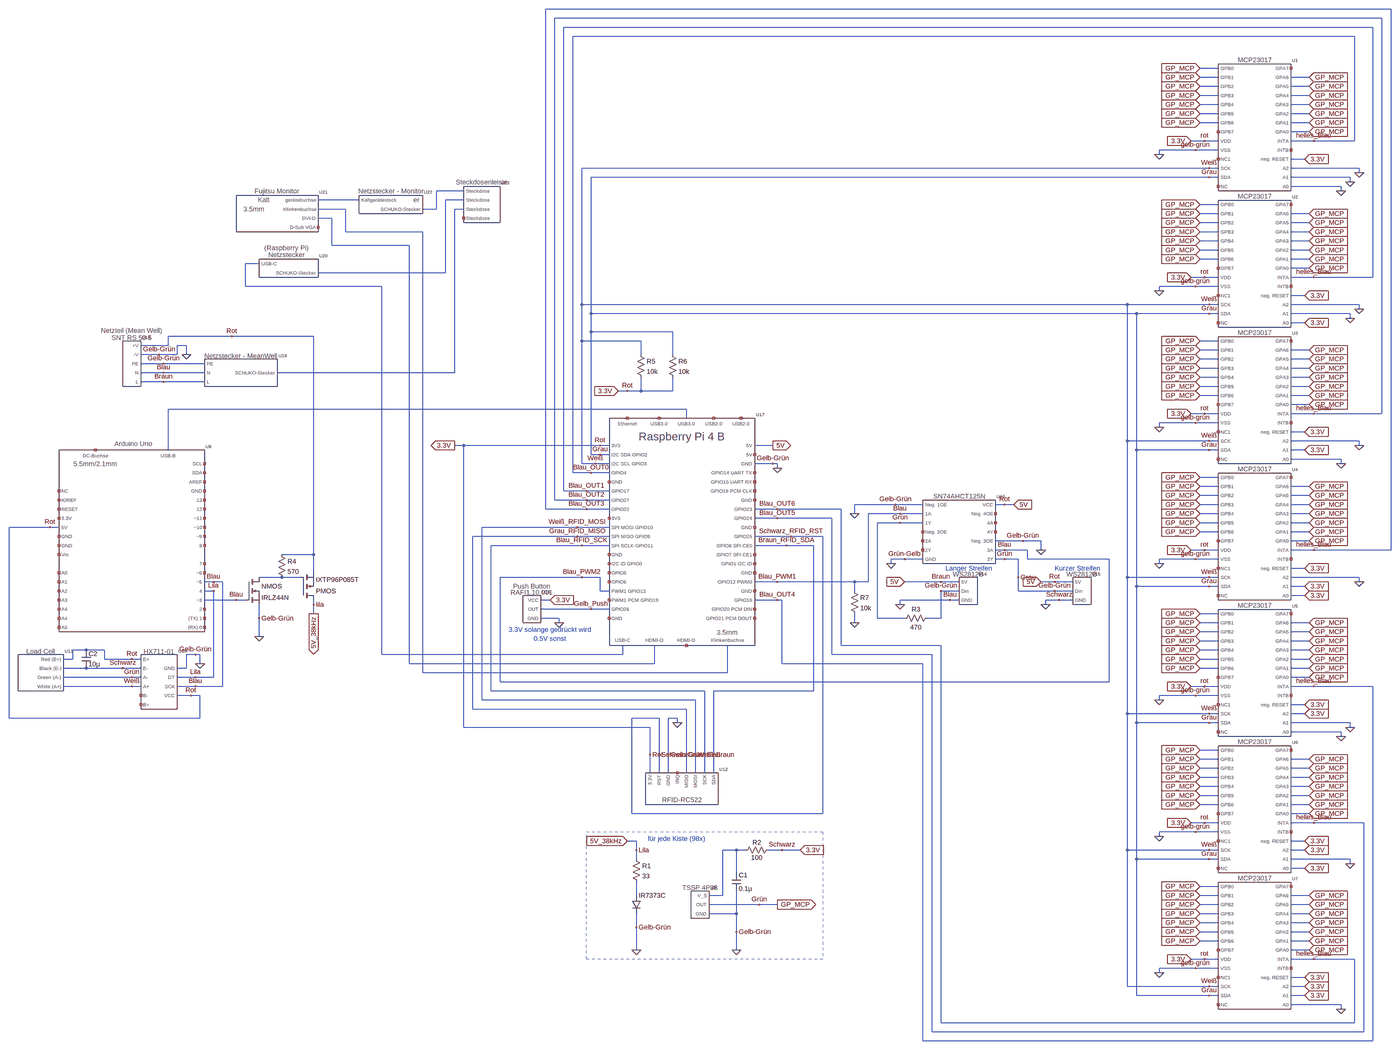
[diagram p0: schematic 260305_Schaltung_Pick-by-Light.asc, whole sheet]
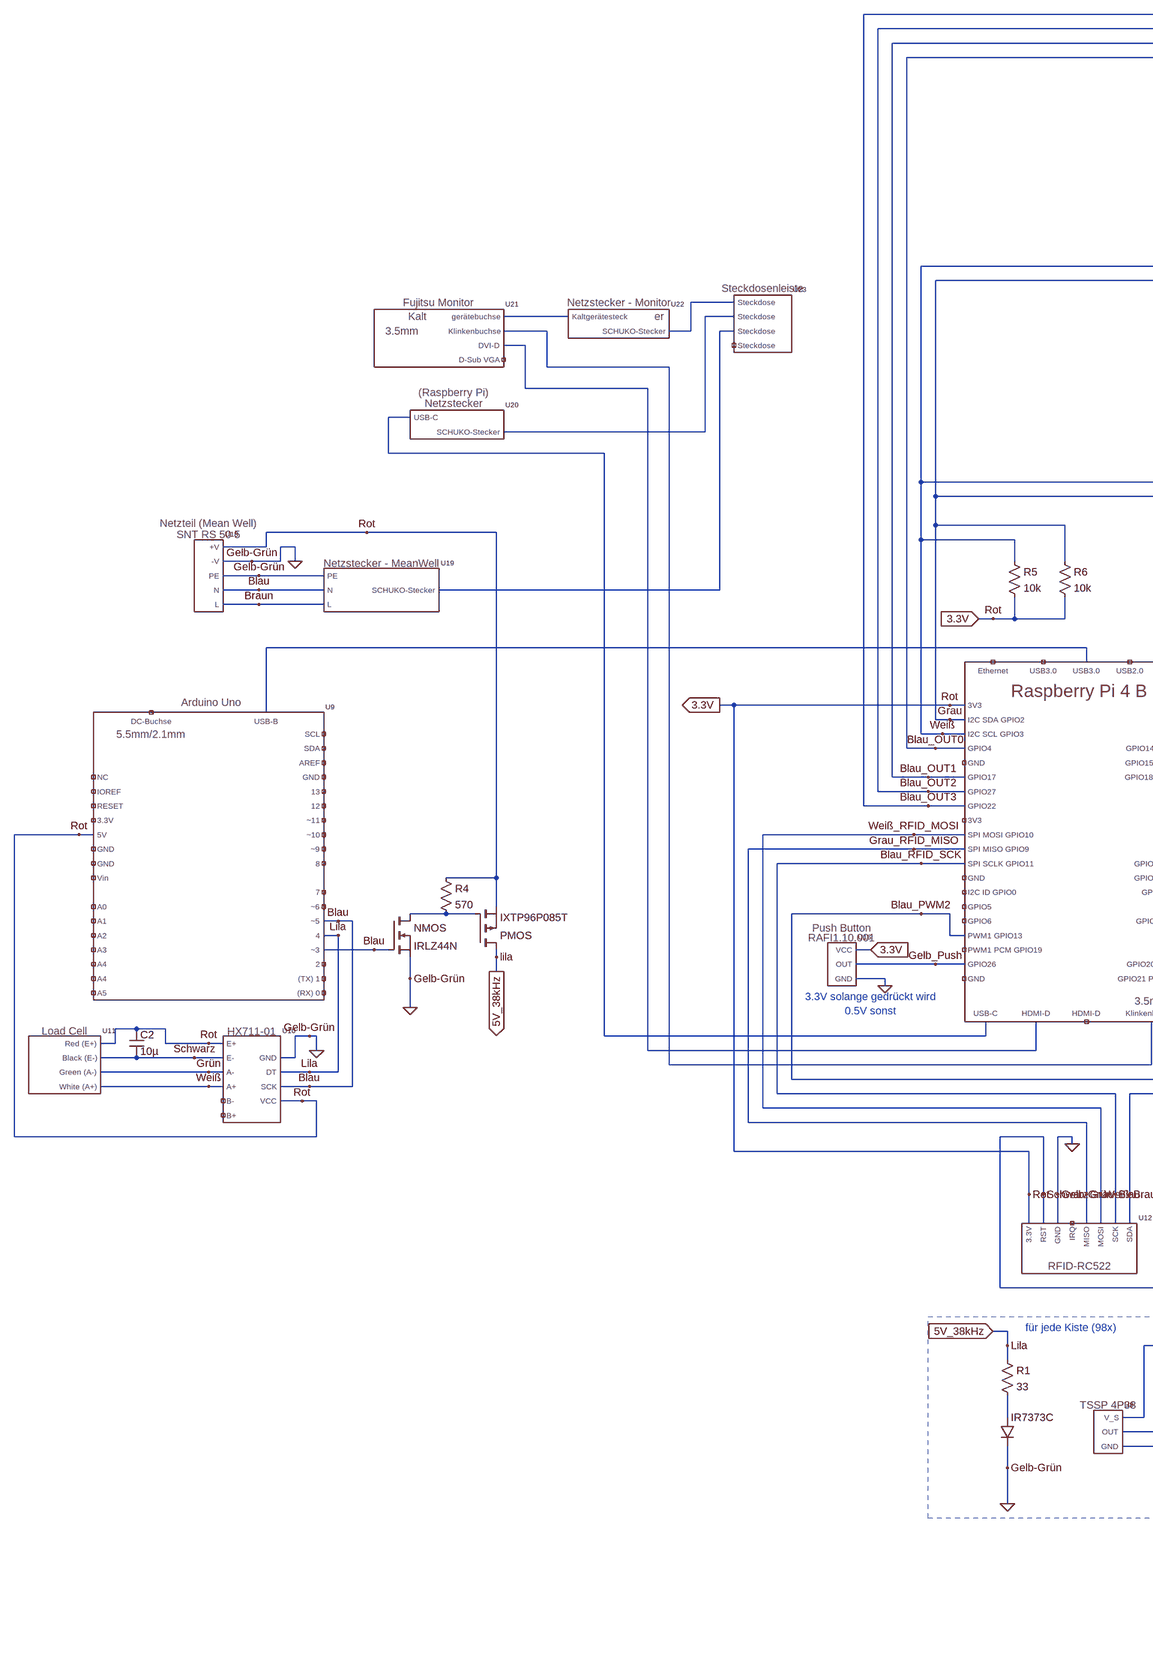
[diagram p1: schematic 260305_Schaltung_Pick-by-Light.asc, part, row 1 of 1, column 1 of 2]
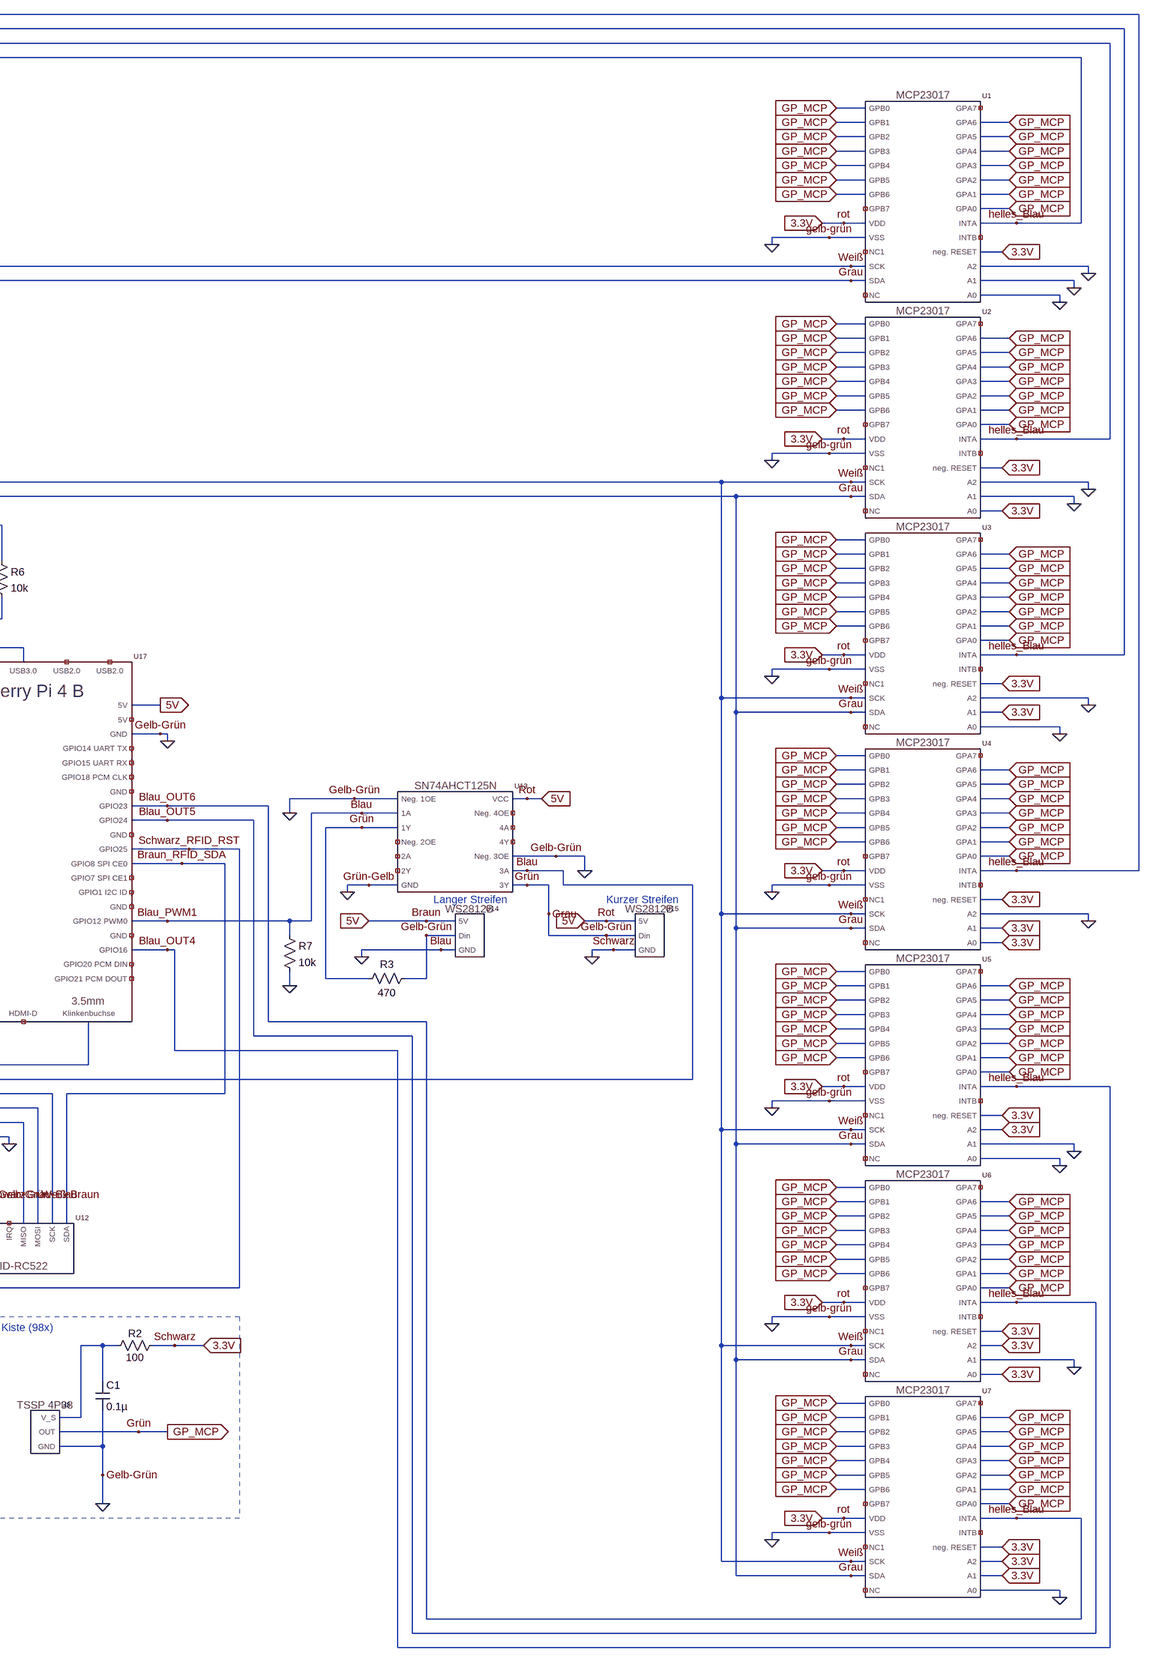
[diagram p2: schematic 260305_Schaltung_Pick-by-Light.asc, part, row 1 of 1, column 2 of 2]
260305_Schaltung_Pick-by-Light.asc, the LTspice schematic file:
Version 4
SHEET 1 2196 3236
WIRE 2048 -416 -928 -416
WIRE 2016 -384 -896 -384
WIRE 1984 -352 -864 -352
WIRE 1920 -320 -832 -320
WIRE 1440 -208 1376 -208
WIRE 1440 -176 1376 -176
WIRE 1760 -176 1696 -176
WIRE 1440 -144 1376 -144
WIRE 1760 -144 1696 -144
WIRE 1440 -112 1376 -112
WIRE 1760 -112 1696 -112
WIRE 1440 -80 1376 -80
WIRE 1760 -80 1696 -80
WIRE 1440 -48 1376 -48
WIRE 1760 -48 1696 -48
WIRE 1440 -16 1376 -16
WIRE 1760 -16 1696 -16
WIRE 1760 16 1696 16
WIRE 1392 48 1344 48
WIRE 1440 48 1392 48
WIRE 1776 48 1696 48
WIRE 1920 48 1920 -320
WIRE 1920 48 1776 48
WIRE 1360 80 1232 80
WIRE 1440 80 1360 80
WIRE 1232 96 1232 80
WIRE 1744 112 1696 112
WIRE 1408 144 -800 144
WIRE 1440 144 1408 144
WIRE 1936 144 1696 144
WIRE 1936 160 1936 144
WIRE 1408 176 -768 176
WIRE 1440 176 1408 176
WIRE 1904 176 1696 176
WIRE 1904 192 1904 176
WIRE 1872 208 1696 208
WIRE -1216 224 -1312 224
WIRE 1872 224 1872 208
WIRE -1584 256 -1728 256
WIRE -1216 256 -1280 256
WIRE 1440 272 1376 272
WIRE -1632 288 -1728 288
WIRE -1312 288 -1312 224
WIRE -1312 288 -1360 288
WIRE -1216 288 -1248 288
WIRE 1440 304 1376 304
WIRE 1760 304 1696 304
WIRE -1680 320 -1728 320
WIRE 1440 336 1376 336
WIRE 1760 336 1696 336
WIRE -1632 368 -1632 288
WIRE -1360 368 -1632 368
WIRE 1440 368 1376 368
WIRE 1760 368 1696 368
WIRE 1440 400 1376 400
WIRE 1760 400 1696 400
WIRE -1680 416 -1680 320
WIRE -1408 416 -1680 416
WIRE 1440 432 1376 432
WIRE 1760 432 1696 432
WIRE 1440 464 1376 464
WIRE 1760 464 1696 464
WIRE -1936 480 -1984 480
WIRE 1760 496 1696 496
WIRE -1280 512 -1280 256
WIRE -1280 512 -1728 512
WIRE 1392 528 1344 528
WIRE 1440 528 1392 528
WIRE 1776 528 1696 528
WIRE 1984 528 1984 -352
WIRE 1984 528 1776 528
WIRE -1984 560 -1984 480
WIRE -1504 560 -1984 560
WIRE 1360 560 1232 560
WIRE 1440 560 1360 560
WIRE 1232 576 1232 560
WIRE 1744 592 1696 592
WIRE -800 624 -800 144
WIRE 1120 624 -800 624
WIRE 1408 624 1120 624
WIRE 1440 624 1408 624
WIRE 1936 624 1696 624
WIRE 1936 640 1936 624
WIRE -768 656 -768 176
WIRE 1152 656 -768 656
WIRE 1408 656 1152 656
WIRE 1440 656 1408 656
WIRE 1904 656 1696 656
WIRE 1904 672 1904 656
WIRE 1744 688 1696 688
WIRE -768 720 -768 656
WIRE -480 720 -768 720
WIRE -2032 736 -2256 736
WIRE -1744 736 -2032 736
WIRE -800 752 -800 624
WIRE -592 752 -800 752
WIRE 1440 752 1376 752
WIRE -2256 768 -2256 736
WIRE -2256 768 -2352 768
WIRE -2192 768 -2224 768
WIRE 1440 784 1376 784
WIRE 1760 784 1696 784
WIRE -2288 800 -2352 800
WIRE -2224 800 -2224 768
WIRE -2224 800 -2288 800
WIRE -2192 800 -2192 768
WIRE -592 800 -592 752
WIRE -480 800 -480 720
WIRE 1440 816 1376 816
WIRE 1760 816 1696 816
WIRE -2272 832 -2352 832
WIRE -2128 832 -2272 832
WIRE 1440 848 1376 848
WIRE 1760 848 1696 848
WIRE -2272 864 -2352 864
WIRE -2128 864 -2272 864
WIRE -1248 864 -1248 288
WIRE -1248 864 -1872 864
WIRE 1440 880 1376 880
WIRE 1760 880 1696 880
WIRE -2272 896 -2352 896
WIRE -2128 896 -2272 896
WIRE 1440 912 1376 912
WIRE 1760 912 1696 912
WIRE -640 928 -672 928
WIRE -592 928 -592 880
WIRE -592 928 -640 928
WIRE -480 928 -480 880
WIRE -480 928 -592 928
WIRE 1440 944 1376 944
WIRE 1760 944 1696 944
WIRE 1760 976 1696 976
WIRE -432 992 -2256 992
WIRE 1392 1008 1344 1008
WIRE 1440 1008 1392 1008
WIRE 1776 1008 1696 1008
WIRE 2016 1008 2016 -384
WIRE 2016 1008 1776 1008
WIRE -432 1024 -432 992
WIRE 1360 1040 1232 1040
WIRE 1440 1040 1360 1040
WIRE 1232 1056 1232 1040
WIRE 1744 1072 1696 1072
WIRE 1120 1104 1120 624
WIRE 1408 1104 1120 1104
WIRE 1440 1104 1408 1104
WIRE 1936 1104 1696 1104
WIRE -1216 1120 -1248 1120
WIRE -736 1120 -1216 1120
WIRE -704 1120 -736 1120
WIRE -128 1120 -192 1120
WIRE 1936 1120 1936 1104
WIRE -2256 1136 -2256 992
WIRE 1152 1136 1152 656
WIRE 1408 1136 1152 1136
WIRE 1440 1136 1408 1136
WIRE 1744 1136 1696 1136
WIRE -768 1152 -768 720
WIRE -736 1152 -768 1152
WIRE -704 1152 -736 1152
WIRE 1872 1168 1696 1168
WIRE -800 1184 -800 752
WIRE -752 1184 -800 1184
WIRE -704 1184 -752 1184
WIRE -128 1184 -192 1184
WIRE -112 1184 -128 1184
WIRE 1872 1184 1872 1168
WIRE -112 1200 -112 1184
WIRE -832 1216 -832 -320
WIRE -768 1216 -832 1216
WIRE -704 1216 -768 1216
WIRE 1440 1232 1376 1232
WIRE 1440 1264 1376 1264
WIRE 1760 1264 1696 1264
WIRE -864 1280 -864 -352
WIRE -784 1280 -864 1280
WIRE -704 1280 -784 1280
WIRE 1440 1296 1376 1296
WIRE 1760 1296 1696 1296
WIRE -896 1312 -896 -384
WIRE -784 1312 -896 1312
WIRE -704 1312 -784 1312
WIRE 304 1328 160 1328
WIRE 400 1328 304 1328
WIRE 688 1328 656 1328
WIRE 720 1328 688 1328
WIRE 1440 1328 1376 1328
WIRE 1760 1328 1696 1328
WIRE -928 1344 -928 -416
WIRE -784 1344 -928 1344
WIRE -704 1344 -784 1344
WIRE -112 1344 -192 1344
WIRE 112 1344 -112 1344
WIRE 160 1360 160 1328
WIRE 320 1360 208 1360
WIRE 400 1360 320 1360
WIRE 1440 1360 1376 1360
WIRE 1760 1360 1696 1360
WIRE -112 1376 -192 1376
WIRE 80 1376 -112 1376
WIRE 320 1392 240 1392
WIRE 400 1392 320 1392
WIRE 1440 1392 1376 1392
WIRE 1760 1392 1696 1392
WIRE -2672 1408 -2816 1408
WIRE -2640 1408 -2672 1408
WIRE -816 1408 -1152 1408
WIRE -704 1408 -816 1408
WIRE 1440 1424 1376 1424
WIRE 1760 1424 1696 1424
WIRE -816 1440 -1184 1440
WIRE -704 1440 -816 1440
WIRE -64 1440 -192 1440
WIRE 48 1440 -64 1440
WIRE 752 1456 656 1456
WIRE 816 1456 752 1456
WIRE 1760 1456 1696 1456
WIRE -800 1472 -1120 1472
WIRE -704 1472 -800 1472
WIRE -80 1472 -192 1472
WIRE 16 1472 -80 1472
WIRE 688 1488 656 1488
WIRE 768 1488 688 1488
WIRE 816 1488 816 1456
WIRE 1392 1488 1344 1488
WIRE 1440 1488 1392 1488
WIRE 1776 1488 1696 1488
WIRE 2048 1488 2048 -416
WIRE 2048 1488 1776 1488
WIRE -1744 1504 -1744 736
WIRE -1744 1504 -1856 1504
WIRE 336 1520 288 1520
WIRE 400 1520 336 1520
WIRE 688 1520 656 1520
WIRE 736 1520 688 1520
WIRE 768 1520 768 1488
WIRE 1056 1520 768 1520
WIRE 1360 1520 1232 1520
WIRE 1440 1520 1360 1520
WIRE 288 1536 288 1520
WIRE 1232 1536 1232 1520
WIRE 1744 1552 1696 1552
WIRE -1744 1568 -1744 1504
WIRE -1856 1584 -1936 1584
WIRE -1792 1584 -1856 1584
WIRE -800 1584 -1088 1584
WIRE -736 1584 -800 1584
WIRE 736 1584 736 1520
WIRE 1120 1584 1120 1104
WIRE 1408 1584 1120 1584
WIRE 1440 1584 1408 1584
WIRE 1936 1584 1696 1584
WIRE -2096 1600 -2128 1600
WIRE -2064 1600 -2096 1600
WIRE -112 1600 -192 1600
WIRE 160 1600 -112 1600
WIRE 208 1600 208 1360
WIRE 208 1600 160 1600
WIRE 464 1600 336 1600
WIRE 528 1600 464 1600
WIRE 864 1600 816 1600
WIRE 928 1600 864 1600
WIRE 1936 1600 1936 1584
WIRE 1152 1616 1152 1136
WIRE 1408 1616 1152 1616
WIRE 1440 1616 1408 1616
WIRE 1744 1616 1696 1616
WIRE -2096 1632 -2128 1632
WIRE -736 1632 -736 1584
WIRE -704 1632 -736 1632
WIRE 160 1632 160 1600
WIRE 528 1632 464 1632
WIRE 736 1632 736 1584
WIRE 864 1632 736 1632
WIRE 928 1632 864 1632
WIRE 1744 1648 1696 1648
WIRE -2016 1664 -2128 1664
WIRE -1984 1664 -2016 1664
WIRE -912 1664 -944 1664
WIRE -112 1664 -192 1664
WIRE -96 1664 -112 1664
WIRE 496 1664 320 1664
WIRE 528 1664 496 1664
WIRE 880 1664 832 1664
WIRE 928 1664 880 1664
WIRE -1744 1680 -1744 1664
WIRE 320 1680 320 1664
WIRE 832 1680 832 1664
WIRE -768 1696 -944 1696
WIRE -704 1696 -768 1696
WIRE -1744 1712 -1744 1680
WIRE 1440 1712 1376 1712
WIRE -1936 1728 -1936 1680
WIRE -880 1728 -944 1728
WIRE 240 1728 240 1392
WIRE 336 1728 240 1728
WIRE 464 1728 464 1632
WIRE 464 1728 416 1728
WIRE -880 1744 -880 1728
WIRE 160 1744 160 1712
WIRE 1440 1744 1376 1744
WIRE 1760 1744 1696 1744
WIRE 1440 1776 1376 1776
WIRE 1760 1776 1696 1776
WIRE -1936 1792 -1936 1728
WIRE 1440 1808 1376 1808
WIRE 1760 1808 1696 1808
WIRE 112 1824 112 1344
WIRE 464 1824 112 1824
WIRE -2544 1840 -2592 1840
WIRE -2480 1840 -2544 1840
WIRE 1440 1840 1376 1840
WIRE 1760 1840 1696 1840
WIRE -2160 1856 -2192 1856
WIRE -2144 1856 -2160 1856
WIRE -1504 1856 -1504 560
WIRE -656 1856 -656 1824
WIRE -656 1856 -1504 1856
WIRE 80 1856 80 1376
WIRE 432 1856 80 1856
WIRE -2592 1872 -2592 1840
WIRE -2592 1872 -2624 1872
WIRE -2480 1872 -2480 1840
WIRE -2384 1872 -2480 1872
WIRE -2352 1872 -2384 1872
WIRE 1440 1872 1376 1872
WIRE 1760 1872 1696 1872
WIRE -2144 1888 -2144 1856
WIRE -1408 1888 -1408 416
WIRE -544 1888 -544 1824
WIRE -544 1888 -1408 1888
WIRE -96 1888 -96 1664
WIRE 400 1888 -96 1888
WIRE -2544 1904 -2624 1904
WIRE -2416 1904 -2544 1904
WIRE -2352 1904 -2416 1904
WIRE -2192 1904 -2192 1856
WIRE -2192 1904 -2224 1904
WIRE 1440 1904 1376 1904
WIRE 1760 1904 1696 1904
WIRE -1360 1920 -1360 368
WIRE -288 1920 -288 1824
WIRE -288 1920 -1360 1920
WIRE -2384 1936 -2624 1936
WIRE -2352 1936 -2384 1936
WIRE -2160 1936 -2224 1936
WIRE -2096 1936 -2096 1632
WIRE -2096 1936 -2160 1936
WIRE 1760 1936 1696 1936
WIRE -1088 1952 -1088 1584
WIRE 1056 1952 1056 1520
WIRE 1056 1952 -1088 1952
WIRE -2384 1968 -2624 1968
WIRE -2352 1968 -2384 1968
WIRE -2160 1968 -2224 1968
WIRE -2064 1968 -2064 1600
WIRE -2064 1968 -2160 1968
WIRE 1392 1968 1344 1968
WIRE 1440 1968 1392 1968
WIRE 1776 1968 1696 1968
WIRE 1984 1968 1776 1968
WIRE -1120 1984 -1120 1472
WIRE -368 1984 -1120 1984
WIRE 16 1984 16 1472
WIRE 16 1984 -336 1984
WIRE -2176 2000 -2224 2000
WIRE -2144 2000 -2176 2000
WIRE 1360 2000 1232 2000
WIRE 1440 2000 1360 2000
WIRE -1152 2016 -1152 1408
WIRE -400 2016 -1152 2016
WIRE 1232 2016 1232 2000
WIRE 1744 2032 1696 2032
WIRE -1184 2048 -1184 1440
WIRE -432 2048 -1184 2048
WIRE 1120 2064 1120 1584
WIRE 1408 2064 1120 2064
WIRE 1440 2064 1408 2064
WIRE 1744 2064 1696 2064
WIRE -2816 2080 -2816 1408
WIRE -2144 2080 -2144 2000
WIRE -2144 2080 -2816 2080
WIRE -528 2080 -624 2080
WIRE -464 2080 -496 2080
WIRE -464 2096 -464 2080
WIRE 1152 2096 1152 1616
WIRE 1408 2096 1152 2096
WIRE 1440 2096 1408 2096
WIRE 1904 2096 1696 2096
WIRE -1216 2112 -1216 1120
WIRE -560 2112 -1216 2112
WIRE 1904 2112 1904 2096
WIRE 1872 2128 1696 2128
WIRE 1872 2144 1872 2128
WIRE 1440 2192 1376 2192
WIRE -560 2208 -560 2112
WIRE -528 2208 -528 2080
WIRE -496 2208 -496 2080
WIRE -432 2208 -432 2048
WIRE -400 2208 -400 2016
WIRE -368 2208 -368 1984
WIRE -336 2208 -336 1984
WIRE 1440 2224 1376 2224
WIRE 1760 2224 1696 2224
WIRE 1440 2256 1376 2256
WIRE 1760 2256 1696 2256
WIRE -560 2272 -560 2208
WIRE -528 2272 -528 2208
WIRE -496 2272 -496 2208
WIRE -432 2272 -432 2208
WIRE -400 2272 -400 2208
WIRE -368 2272 -368 2208
WIRE -336 2272 -336 2208
WIRE 1440 2288 1376 2288
WIRE 1760 2288 1696 2288
WIRE 1440 2320 1376 2320
WIRE 1760 2320 1696 2320
WIRE 1440 2352 1376 2352
WIRE 1760 2352 1696 2352
WIRE 1440 2384 1376 2384
WIRE 1760 2384 1696 2384
WIRE -624 2416 -624 2080
WIRE 48 2416 48 1440
WIRE 48 2416 -624 2416
WIRE 1760 2416 1696 2416
WIRE 1392 2448 1344 2448
WIRE 1440 2448 1392 2448
WIRE 1776 2448 1696 2448
WIRE 1952 2448 1776 2448
WIRE 1360 2480 1232 2480
WIRE 1440 2480 1360 2480
WIRE 1232 2496 1232 2480
WIRE -608 2512 -640 2512
WIRE 1744 2512 1696 2512
WIRE -608 2544 -608 2512
WIRE -256 2544 -304 2544
WIRE -224 2544 -256 2544
WIRE -96 2544 -144 2544
WIRE -32 2544 -96 2544
WIRE 1120 2544 1120 2064
WIRE 1408 2544 1120 2544
WIRE 1440 2544 1408 2544
WIRE 1744 2544 1696 2544
WIRE -608 2576 -608 2544
WIRE 1152 2576 1152 2096
WIRE 1408 2576 1152 2576
WIRE 1440 2576 1408 2576
WIRE 1904 2576 1696 2576
WIRE 1904 2592 1904 2576
WIRE 1744 2608 1696 2608
WIRE -256 2624 -256 2544
WIRE 1440 2672 1376 2672
WIRE -608 2704 -608 2656
WIRE -304 2704 -304 2544
WIRE -304 2704 -352 2704
WIRE 1440 2704 1376 2704
WIRE 1760 2704 1696 2704
WIRE -176 2736 -352 2736
WIRE -112 2736 -176 2736
WIRE 1440 2736 1376 2736
WIRE 1760 2736 1696 2736
WIRE -256 2768 -256 2688
WIRE -256 2768 -352 2768
WIRE 1440 2768 1376 2768
WIRE 1760 2768 1696 2768
WIRE 1440 2800 1376 2800
WIRE 1760 2800 1696 2800
WIRE -608 2816 -608 2768
WIRE -256 2832 -256 2768
WIRE 1440 2832 1376 2832
WIRE 1760 2832 1696 2832
WIRE 1440 2864 1376 2864
WIRE 1760 2864 1696 2864
WIRE -608 2896 -608 2816
WIRE -256 2896 -256 2832
WIRE 1760 2896 1696 2896
WIRE 1392 2928 1344 2928
WIRE 1440 2928 1392 2928
WIRE 1776 2928 1696 2928
WIRE 1920 2928 1776 2928
WIRE 1360 2960 1232 2960
WIRE 1440 2960 1360 2960
WIRE 1232 2976 1232 2960
WIRE 1744 2992 1696 2992
WIRE 1120 3024 1120 2544
WIRE 1408 3024 1120 3024
WIRE 1440 3024 1408 3024
WIRE 1744 3024 1696 3024
WIRE 1152 3056 1152 2576
WIRE 1408 3056 1152 3056
WIRE 1440 3056 1408 3056
WIRE 1744 3056 1696 3056
WIRE 1872 3088 1696 3088
WIRE 1872 3104 1872 3088
WIRE 464 3152 464 1824
WIRE 1920 3152 1920 2928
WIRE 1920 3152 464 3152
WIRE 432 3184 432 1856
WIRE 1952 3184 1952 2448
WIRE 1952 3184 432 3184
WIRE 400 3216 400 1888
WIRE 1984 3216 1984 1968
WIRE 1984 3216 400 3216
FLAG -128 1120 5V
IOPIN -128 1120 Out
FLAG 1344 528 3.3V
IOPIN 1344 528 In
FLAG 1344 48 3.3V
IOPIN 1344 48 In
FLAG 1344 1008 3.3V
IOPIN 1344 1008 In
FLAG 1344 1488 3.3V
IOPIN 1344 1488 In
FLAG 1344 1968 3.3V
IOPIN 1344 1968 In
FLAG 1344 2448 3.3V
IOPIN 1344 2448 In
FLAG 1344 2928 3.3V
IOPIN 1344 2928 In
FLAG 1744 688 3.3V
IOPIN 1744 688 In
FLAG 1744 1136 3.3V
IOPIN 1744 1136 In
FLAG 1744 1616 3.3V
IOPIN 1744 1616 In
FLAG 1744 1648 3.3V
IOPIN 1744 1648 In
FLAG 1744 2064 3.3V
IOPIN 1744 2064 In
FLAG 1744 2544 3.3V
IOPIN 1744 2544 In
FLAG 1744 2608 3.3V
IOPIN 1744 2608 In
FLAG 1744 3024 3.3V
IOPIN 1744 3024 In
FLAG 1744 3056 3.3V
IOPIN 1744 3056 In
FLAG -112 1200 0
FLAG 1936 1120 0
FLAG 1872 1184 0
FLAG 1936 1600 0
FLAG 1904 2112 0
FLAG 1872 2144 0
FLAG 1904 2592 0
FLAG 1872 3104 0
FLAG 1936 160 0
FLAG 1904 192 0
FLAG 1872 224 0
FLAG 1904 672 0
FLAG 1936 640 0
FLAG 1232 96 0
FLAG 1232 576 0
FLAG 1232 2976 0
FLAG 1232 2496 0
FLAG 1232 2016 0
FLAG 1232 1536 0
FLAG 1232 1056 0
FLAG 1744 1552 3.3V
IOPIN 1744 1552 In
FLAG 1744 1072 3.3V
IOPIN 1744 1072 In
FLAG 1744 592 3.3V
IOPIN 1744 592 In
FLAG 1744 112 3.3V
IOPIN 1744 112 In
FLAG 1744 2032 3.3V
IOPIN 1744 2032 In
FLAG 1744 2512 3.3V
IOPIN 1744 2512 In
FLAG 1744 2992 3.3V
IOPIN 1744 2992 In
FLAG -640 2512 5V_38kHz
IOPIN -640 2512 In
FLAG -608 2896 0
FLAG -32 2544 3.3V
IOPIN -32 2544 In
FLAG -256 2896 0
FLAG -112 2736 GP_MCP
IOPIN -112 2736 Out
FLAG 1376 -208 GP_MCP
IOPIN 1376 -208 In
FLAG 1376 -176 GP_MCP
IOPIN 1376 -176 In
FLAG 1376 -144 GP_MCP
IOPIN 1376 -144 In
FLAG 1376 -112 GP_MCP
IOPIN 1376 -112 In
FLAG 1376 -80 GP_MCP
IOPIN 1376 -80 In
FLAG 1376 -48 GP_MCP
IOPIN 1376 -48 In
FLAG 1376 -16 GP_MCP
IOPIN 1376 -16 In
FLAG 1760 -176 GP_MCP
IOPIN 1760 -176 In
FLAG 1760 -144 GP_MCP
IOPIN 1760 -144 In
FLAG 1760 -112 GP_MCP
IOPIN 1760 -112 In
FLAG 1760 -80 GP_MCP
IOPIN 1760 -80 In
FLAG 1760 -48 GP_MCP
IOPIN 1760 -48 In
FLAG 1760 -16 GP_MCP
IOPIN 1760 -16 In
FLAG 1760 16 GP_MCP
IOPIN 1760 16 In
FLAG 1760 304 GP_MCP
IOPIN 1760 304 In
FLAG 1760 336 GP_MCP
IOPIN 1760 336 In
FLAG 1760 368 GP_MCP
IOPIN 1760 368 In
FLAG 1760 400 GP_MCP
IOPIN 1760 400 In
FLAG 1760 432 GP_MCP
IOPIN 1760 432 In
FLAG 1760 464 GP_MCP
IOPIN 1760 464 In
FLAG 1760 496 GP_MCP
IOPIN 1760 496 In
FLAG 1760 784 GP_MCP
IOPIN 1760 784 In
FLAG 1760 816 GP_MCP
IOPIN 1760 816 In
FLAG 1760 848 GP_MCP
IOPIN 1760 848 In
FLAG 1760 880 GP_MCP
IOPIN 1760 880 In
FLAG 1760 912 GP_MCP
IOPIN 1760 912 In
FLAG 1760 944 GP_MCP
IOPIN 1760 944 In
FLAG 1760 976 GP_MCP
IOPIN 1760 976 In
FLAG 1760 1264 GP_MCP
IOPIN 1760 1264 In
FLAG 1760 1296 GP_MCP
IOPIN 1760 1296 In
FLAG 1760 1328 GP_MCP
IOPIN 1760 1328 In
FLAG 1760 1360 GP_MCP
IOPIN 1760 1360 In
FLAG 1760 1392 GP_MCP
IOPIN 1760 1392 In
FLAG 1760 1424 GP_MCP
IOPIN 1760 1424 In
FLAG 1760 1456 GP_MCP
IOPIN 1760 1456 In
FLAG 1760 1744 GP_MCP
IOPIN 1760 1744 In
FLAG 1760 1776 GP_MCP
IOPIN 1760 1776 In
FLAG 1760 1808 GP_MCP
IOPIN 1760 1808 In
FLAG 1760 1840 GP_MCP
IOPIN 1760 1840 In
FLAG 1760 1872 GP_MCP
IOPIN 1760 1872 In
FLAG 1760 1904 GP_MCP
IOPIN 1760 1904 In
FLAG 1760 1936 GP_MCP
IOPIN 1760 1936 In
FLAG 1760 2224 GP_MCP
IOPIN 1760 2224 In
FLAG 1760 2256 GP_MCP
IOPIN 1760 2256 In
FLAG 1760 2288 GP_MCP
IOPIN 1760 2288 In
FLAG 1760 2320 GP_MCP
IOPIN 1760 2320 In
FLAG 1760 2352 GP_MCP
IOPIN 1760 2352 In
FLAG 1760 2384 GP_MCP
IOPIN 1760 2384 In
FLAG 1760 2416 GP_MCP
IOPIN 1760 2416 In
FLAG 1760 2704 GP_MCP
IOPIN 1760 2704 In
FLAG 1760 2736 GP_MCP
IOPIN 1760 2736 In
FLAG 1760 2768 GP_MCP
IOPIN 1760 2768 In
FLAG 1760 2800 GP_MCP
IOPIN 1760 2800 In
FLAG 1760 2832 GP_MCP
IOPIN 1760 2832 In
FLAG 1760 2864 GP_MCP
IOPIN 1760 2864 In
FLAG 1760 2896 GP_MCP
IOPIN 1760 2896 In
FLAG 1376 272 GP_MCP
IOPIN 1376 272 In
FLAG 1376 304 GP_MCP
IOPIN 1376 304 In
FLAG 1376 336 GP_MCP
IOPIN 1376 336 In
FLAG 1376 368 GP_MCP
IOPIN 1376 368 In
FLAG 1376 400 GP_MCP
IOPIN 1376 400 In
FLAG 1376 432 GP_MCP
IOPIN 1376 432 In
FLAG 1376 464 GP_MCP
IOPIN 1376 464 In
FLAG 1376 752 GP_MCP
IOPIN 1376 752 In
FLAG 1376 784 GP_MCP
IOPIN 1376 784 In
FLAG 1376 816 GP_MCP
IOPIN 1376 816 In
FLAG 1376 848 GP_MCP
IOPIN 1376 848 In
FLAG 1376 880 GP_MCP
IOPIN 1376 880 In
FLAG 1376 912 GP_MCP
IOPIN 1376 912 In
FLAG 1376 944 GP_MCP
IOPIN 1376 944 In
FLAG 1376 1232 GP_MCP
IOPIN 1376 1232 In
FLAG 1376 1264 GP_MCP
IOPIN 1376 1264 In
FLAG 1376 1296 GP_MCP
IOPIN 1376 1296 In
FLAG 1376 1328 GP_MCP
IOPIN 1376 1328 In
FLAG 1376 1360 GP_MCP
IOPIN 1376 1360 In
FLAG 1376 1392 GP_MCP
IOPIN 1376 1392 In
FLAG 1376 1424 GP_MCP
IOPIN 1376 1424 In
FLAG 1376 1712 GP_MCP
IOPIN 1376 1712 In
FLAG 1376 1744 GP_MCP
IOPIN 1376 1744 In
FLAG 1376 1776 GP_MCP
IOPIN 1376 1776 In
FLAG 1376 1808 GP_MCP
IOPIN 1376 1808 In
FLAG 1376 1840 GP_MCP
IOPIN 1376 1840 In
FLAG 1376 1872 GP_MCP
IOPIN 1376 1872 In
FLAG 1376 1904 GP_MCP
IOPIN 1376 1904 In
FLAG 1376 2192 GP_MCP
IOPIN 1376 2192 In
FLAG 1376 2224 GP_MCP
IOPIN 1376 2224 In
FLAG 1376 2256 GP_MCP
IOPIN 1376 2256 In
FLAG 1376 2288 GP_MCP
IOPIN 1376 2288 In
FLAG 1376 2320 GP_MCP
IOPIN 1376 2320 In
FLAG 1376 2352 GP_MCP
IOPIN 1376 2352 In
FLAG 1376 2384 GP_MCP
IOPIN 1376 2384 In
FLAG 1376 2672 GP_MCP
IOPIN 1376 2672 In
FLAG 1376 2704 GP_MCP
IOPIN 1376 2704 In
FLAG 1376 2736 GP_MCP
IOPIN 1376 2736 In
FLAG 1376 2768 GP_MCP
IOPIN 1376 2768 In
FLAG 1376 2800 GP_MCP
IOPIN 1376 2800 In
FLAG 1376 2832 GP_MCP
IOPIN 1376 2832 In
FLAG 1376 2864 GP_MCP
IOPIN 1376 2864 In
FLAG -464 2096 0
FLAG -560 2208 Rot
FLAG -528 2208 Schwarz
FLAG -496 2208 Gelb-Grün
FLAG -368 2208 Blau
FLAG -400 2208 Weiß
FLAG -432 2208 Grau
FLAG -336 2208 Braun
FLAG 720 1328 5V
IOPIN 720 1328 In
FLAG 288 1536 0
FLAG 160 1360 0
FLAG 336 1600 5V
IOPIN 336 1600 In
FLAG 320 1680 0
FLAG -2384 1872 Rot
FLAG -2416 1904 Schwarz
FLAG -2384 1936 Grün
FLAG -2384 1968 Weiß
FLAG -2160 1856 Gelb-Grün
FLAG -2160 1968 Blau
FLAG -2176 2000 Rot
FLAG 688 1328 Rot
FLAG 336 1520 Grün-Gelb
FLAG -608 2544 Lila
FLAG -608 2816 Gelb-Grün
FLAG -176 2736 Grün
FLAG -96 2544 Schwarz
FLAG -256 2832 Gelb-Grün
FLAG -1248 1120 3.3V
IOPIN -1248 1120 Out
FLAG 816 1488 0
FLAG 752 1456 Gelb-Grün
FLAG 304 1328 Gelb-Grün
FLAG 320 1392 Grün
FLAG 320 1360 Blau
FLAG 832 1680 0
FLAG 816 1600 5V
IOPIN 816 1600 In
FLAG -912 1664 3.3V
IOPIN -912 1664 In
FLAG 688 1488 Blau
FLAG 688 1520 Grün
FLAG -736 1152 Grau
FLAG -752 1184 Weiß
FLAG 1776 48 helles_Blau
FLAG 1776 528 helles_Blau
FLAG 1776 1008 helles_Blau
FLAG 1776 1488 helles_Blau
FLAG 1776 1968 helles_Blau
FLAG 1776 2448 helles_Blau
FLAG 1776 2928 helles_Blau
FLAG 1392 1488 rot
FLAG 1392 1008 rot
FLAG 1392 528 rot
FLAG 1392 48 rot
FLAG 1392 1968 rot
FLAG 1392 2448 rot
FLAG 1392 2928 rot
FLAG 1360 2960 gelb-grün
FLAG 1360 2480 gelb-grün
FLAG 1360 2000 gelb-grün
FLAG 1360 1520 gelb-grün
FLAG 1360 1040 gelb-grün
FLAG 1360 560 gelb-grün
FLAG 1360 80 gelb-grün
FLAG -672 928 3.3V
IOPIN -672 928 In
FLAG -2160 1936 Lila
FLAG -880 1744 0
FLAG -1936 1792 0
FLAG -1744 1712 5V_38kHz
IOPIN -1744 1712 Out
FLAG -1744 1680 lila
FLAG -2144 1888 0
FLAG -2192 800 0
FLAG -2288 800 Gelb-Grün
FLAG -2032 736 Rot
FLAG -2272 832 Gelb-Grün
FLAG -2272 864 Blau
FLAG -2272 896 Braun
FLAG -2016 1664 Blau
FLAG -1936 1728 Gelb-Grün
FLAG -736 1120 Rot
FLAG -768 1216 Blau_OUT0
FLAG -784 1280 Blau_OUT1
FLAG -784 1312 Blau_OUT2
FLAG -784 1344 Blau_OUT3
FLAG -768 1696 Gelb_Push
FLAG -800 1584 Blau_PWM2
FLAG -800 1472 Blau_RFID_SCK
FLAG -816 1440 Grau_RFID_MISO
FLAG -816 1408 Weiß_RFID_MOSI
FLAG 160 1744 0
FLAG 464 1632 Gelb-Grün
FLAG 496 1664 Blau
FLAG 464 1600 Braun
FLAG 864 1632 Gelb-Grün
FLAG 864 1600 Rot
FLAG 880 1664 Schwarz
FLAG 736 1584 Grau
FLAG -2672 1408 Rot
FLAG -2096 1600 Blau
FLAG -2096 1632 Lila
FLAG -640 928 Rot
FLAG 1408 176 Grau
FLAG 1408 656 Grau
FLAG 1408 1136 Grau
FLAG 1408 1616 Grau
FLAG 1408 2096 Grau
FLAG 1408 2576 Grau
FLAG 1408 3056 Grau
FLAG 1408 3024 Weiß
FLAG 1408 2544 Weiß
FLAG 1408 2064 Weiß
FLAG 1408 1584 Weiß
FLAG 1408 1104 Weiß
FLAG 1408 624 Weiß
FLAG 1408 144 Weiß
FLAG -112 1664 Blau_OUT4
FLAG -112 1600 Blau_PWM1
FLAG -80 1472 Braun_RFID_SDA
FLAG -64 1440 Schwarz_RFID_RST
FLAG -128 1184 Gelb-Grün
FLAG -112 1344 Blau_OUT6
FLAG -112 1376 Blau_OUT5
SYMBOL MCP23017 1568 0 R0
SYMATTR InstName U1
SYMBOL MCP23017 1568 480 R0
SYMATTR InstName U2
SYMBOL MCP23017 1568 960 R0
SYMATTR InstName U3
SYMBOL MCP23017 1568 1440 R0
SYMATTR InstName U4
SYMBOL MCP23017 1568 1920 R0
SYMATTR InstName U5
SYMBOL MCP23017 1568 2400 R0
SYMATTR InstName U6
SYMBOL MCP23017 1568 2880 R0
SYMATTR InstName U7
SYMBOL diode -624 2704 R0
SYMATTR InstName IR7373C
SYMATTR Value ""
SYMBOL res -624 2560 R0
SYMATTR InstName R1
SYMATTR Value 33
SYMBOL res -128 2528 R90
WINDOW 0 5 56 VBottom 2
WINDOW 3 27 56 VTop 2
SYMATTR InstName R2
SYMATTR Value 100
SYMBOL TSSP4P38 -384 2736 R0
SYMATTR InstName U8
SYMBOL cap -272 2624 R0
SYMATTR InstName C1
SYMATTR Value 0.1µ
SYMBOL HX711-01 -2288 1952 R0
SYMATTR InstName U10
SYMBOL LoadCell -2704 1920 R0
SYMATTR InstName U11
SYMBOL RC522 -448 2320 R0
SYMATTR InstName U12
SYMBOL SN74AHCT125N 528 1424 R0
SYMATTR InstName U13
SYMBOL WS2812B 560 1632 R0
SYMATTR InstName U14
SYMBOL res 432 1712 R90
WINDOW 0 0 56 VBottom 2
WINDOW 3 32 56 VTop 2
SYMATTR InstName R3
SYMATTR Value 470
SYMBOL WS2812B 960 1632 R0
SYMATTR InstName U15
SYMBOL PushButton -976 1696 R0
SYMATTR InstName U16
SYMBOL res -608 784 R0
SYMATTR InstName R5
SYMATTR Value 10k
SYMBOL res -496 784 R0
SYMATTR InstName R6
SYMATTR Value 10k
SYMBOL RaspPi4B_Ext -448 1424 R0
SYMATTR InstName U17
SYMBOL Arduino_Uno -2384 1456 R0
SYMATTR InstName U9
SYMBOL nmos -1984 1584 R0
SYMATTR InstName NMOS
SYMATTR Value IRLZ44N
SYMBOL pmos -1792 1664 M180
SYMATTR InstName PMOS
SYMATTR Value IXTP96P085T
SYMBOL res -1872 1488 R0
SYMATTR InstName R4
SYMATTR Value 570
SYMBOL MeanWell_SNT_RS_50_5 -2384 816 R0
SYMATTR InstName U18
SYMBOL Netzstecker_MeanWell -2000 864 R0
SYMATTR InstName U19
SYMBOL Netzstecker_RaspberryPi -1840 480 R0
SYMATTR InstName U20
SYMBOL Fujitsu_Monitor -1872 304 R0
SYMATTR InstName U21
SYMBOL Netzstecker_Monitor -1472 256 R0
SYMATTR InstName U22
SYMBOL Steckdosenleiste -1152 272 R0
SYMATTR InstName U23
SYMBOL res 144 1616 R0
SYMATTR InstName R7
SYMATTR Value 10k
SYMBOL cap -2560 1840 R0
WINDOW 0 24 13 Left 2
WINDOW 3 24 50 Left 2
SYMATTR InstName C2
SYMATTR Value 10µ
TEXT -568 2504 Left 2 ;für jede Kiste (98x)
TEXT 864 1552 Left 2 ;Kurzer Streifen
TEXT 480 1552 Left 2 ;Langer Streifen
TEXT -912 1784 Center 2 ;3.3V solange gedrückt wird\n0.5V sonst
RECTANGLE Normal 48 2928 -784 2480 2

The netlist it stands for:
* 260305_Schaltung_Pick-by-Light.asc
XU1 0 0 0 0 0 0 0 NC_01 0 0 NC_02 Weiß_RFID_MOSI 0 NC_03 0 0 0 0 NC_04 Blau_OUT5 0 0 0 0 0 0 0 NC_05 MCP23017  ; pins GPB0 GPB1 GPB2 GPB3 GPB4 GPB5 GPB6 GPB7 VDD VSS NC1 SCK SDA NC A0 A1 A2 neg._RESET INTB INTA GPA0 GPA1 GPA2 GPA3 GPA4 GPA5 GPA6 GPA7
XU2 0 0 0 0 0 0 0 NC_06 0 0 NC_07 Weiß_RFID_MOSI 0 NC_08 0 0 0 0 NC_09 Blau_OUT5 0 0 0 0 0 0 0 NC_10 MCP23017  ; pins GPB0 GPB1 GPB2 GPB3 GPB4 GPB5 GPB6 GPB7 VDD VSS NC1 SCK SDA NC A0 A1 A2 neg._RESET INTB INTA GPA0 GPA1 GPA2 GPA3 GPA4 GPA5 GPA6 GPA7
XU3 0 0 0 0 0 0 0 NC_11 0 0 NC_12 Weiß_RFID_MOSI 0 NC_13 0 0 0 0 NC_14 Blau_OUT5 0 0 0 0 0 0 0 NC_15 MCP23017  ; pins GPB0 GPB1 GPB2 GPB3 GPB4 GPB5 GPB6 GPB7 VDD VSS NC1 SCK SDA NC A0 A1 A2 neg._RESET INTB INTA GPA0 GPA1 GPA2 GPA3 GPA4 GPA5 GPA6 GPA7
XU4 0 0 0 0 0 0 0 NC_16 0 0 NC_17 Weiß_RFID_MOSI 0 NC_18 0 0 0 0 NC_19 Blau_OUT5 0 0 0 0 0 0 0 NC_20 MCP23017  ; pins GPB0 GPB1 GPB2 GPB3 GPB4 GPB5 GPB6 GPB7 VDD VSS NC1 SCK SDA NC A0 A1 A2 neg._RESET INTB INTA GPA0 GPA1 GPA2 GPA3 GPA4 GPA5 GPA6 GPA7
XU5 0 0 0 0 0 0 0 NC_21 0 0 NC_22 Weiß_RFID_MOSI 0 NC_23 0 0 0 0 NC_24 Blau_OUT5 0 0 0 0 0 0 0 NC_25 MCP23017  ; pins GPB0 GPB1 GPB2 GPB3 GPB4 GPB5 GPB6 GPB7 VDD VSS NC1 SCK SDA NC A0 A1 A2 neg._RESET INTB INTA GPA0 GPA1 GPA2 GPA3 GPA4 GPA5 GPA6 GPA7
XU6 0 0 0 0 0 0 0 NC_26 0 0 NC_27 Weiß_RFID_MOSI 0 NC_28 0 0 0 0 NC_29 Blau_OUT5 0 0 0 0 0 0 0 NC_30 MCP23017  ; pins GPB0 GPB1 GPB2 GPB3 GPB4 GPB5 GPB6 GPB7 VDD VSS NC1 SCK SDA NC A0 A1 A2 neg._RESET INTB INTA GPA0 GPA1 GPA2 GPA3 GPA4 GPA5 GPA6 GPA7
XU7 0 0 0 0 0 0 0 NC_31 0 0 NC_32 Weiß_RFID_MOSI 0 NC_33 0 0 0 0 NC_34 Blau_OUT5 0 0 0 0 0 0 0 NC_35 MCP23017  ; pins GPB0 GPB1 GPB2 GPB3 GPB4 GPB5 GPB6 GPB7 VDD VSS NC1 SCK SDA NC A0 A1 A2 neg._RESET INTB INTA GPA0 GPA1 GPA2 GPA3 GPA4 GPA5 GPA6 GPA7
D§IR7373C N011 0
R1 Lila N011 33
R2 0 N010 100
XU8 N010 0 0 TSSP4P38  ; pins V_S OUT GND
C1 N010 0 0.1µ
XU10 0 Lila 0 0 0 0 0 Weiß_RFID_MOSI NC_36 NC_37 HX711-01  ; pins GND DT SCK VCC E+ E- A- A+ B- B+
XU11 0 0 0 Weiß_RFID_MOSI LoadCell  ; pins Red_(E+) Black_(E-) Green_(A-) White_(A+)
XU12 0 0 Weiß_RFID_MOSI 0 NC_38 0 0 0 RC522  ; pins SDA SCK MOSI MISO IRQ GND RST 3.3V
XU13 0 0 0 NC_39 NC_40 NC_41 0 0 0 0 NC_42 NC_43 NC_44 0 SN74AHCT125N  ; pins Neg._1OE 1A 1Y Neg._2OE 2A 2Y GND 3Y 3A Neg._3OE 4Y 4A Neg._4OE VCC
XU14 0 0 0 WS2812B  ; pins 5V Din GND
R3 0 0 470
XU15 0 0 0 WS2812B  ; pins 5V Din GND
XU16 0 Gelb_Push 0 PushButton  ; pins VCC OUT GND
R5 Weiß_RFID_MOSI 0 10k
R6 0 0 10k
XU17 0 0 0 NC_45 Weiß_RFID_MOSI 0 Blau_OUT5 NC_46 NC_47 NC_48 Blau_OUT5 NC_49 Blau_OUT5 NC_50 Blau_OUT5 Blau_OUT5 NC_51 Blau_OUT5 Weiß_RFID_MOSI NC_52 0 0 0 0 NC_53 NC_54 NC_55 NC_56 NC_57 NC_58 NC_59 0 0 NC_60 NC_61 Blau_OUT5 Gelb_Push NC_62 NC_63 NC_64 N007 N006 NC_65 NC_66 NC_67 N008 NC_68 NC_69 N004 RaspPi4B_Ext  ; pins 3V3 5V I2C_SDA_GPIO2 5V I2C_SCL_GPIO3 GND GPIO4 GPIO14_UART_TX GND GPIO15_UART_RX GPIO17 GPIO18_PCM_CLK GPIO27 GND GPIO22 GPIO23 3V3 GPIO24 SPI_MOSI_GPIO10 GND SPI_MISO_GPIO9 GPIO25 SPI_SCLK_GPIO11 GPIO8_SPI_CE0 GND GPIO7_SPI_CE1 I2C_ID_GPIO0 GPIO1_I2C_ID GPIO5 GND GPIO6 GPIO12_PWM0 PWM1_GPIO13 GND PWM1_PCM_GPIO19 GPIO16 GPIO26 GPIO20_PCM_DIN GND GPIO21_PCM_DOUT USB-C HDMI-D HDMI-D USB2.0 USB2.0 USB3.0 USB3.0 Ethernet Klinkenbuchse
XU9 N008 NC_70 NC_71 NC_72 NC_73 NC_74 NC_75 NC_76 NC_77 NC_78 NC_79 NC_80 NC_81 0 NC_82 NC_83 NC_84 NC_85 NC_86 NC_87 NC_88 NC_89 NC_90 NC_91 0 NC_92 Lila NC_93 0 NC_94 NC_95 NC_96 NC_97 NC_98 NC_99 Arduino_Uno  ; pins USB-B DC-Buchse SCL SDA AREF NC GND IOREF 13 RESET 12 3.3V ~11 5V ~10 GND ~9 GND 8 Vin 7 A0 ~6 A1 ~5 A2 4 A3 ~3 A4 2 A4 (TX)_1 A5 (RX)_0
M§NMOS N009 0 0 0 IRLZ44N
M§PMOS Lila N009 0 0 IXTP96P085T
R4 0 N009 570
XU18 0 0 0 0 0 MeanWell_SNT_RS_50_5  ; pins +V -V PE N L
XU19 0 0 0 N005 Netzstecker_MeanWell  ; pins PE N L SCHUKO-Stecker
XU20 N007 N003 Netzstecker_RaspberryPi  ; pins USB-C SCHUKO-Stecker
XU21 N004 N006 NC_100 N002 Fujitsu_Monitor  ; pins Klinkenbuchse DVI-D D-Sub_VGA gerätebuchse
XU22 N002 N001 Netzstecker_Monitor  ; pins Kaltgerätesteck SCHUKO-Stecker
XU23 N003 N005 NC_101 N001 Steckdosenleiste  ; pins Steckdose Steckdose Steckdose Steckdose
R7 0 0 10k
C2 0 0 10µ
.model D D
.lib standard.dio
.model NMOS NMOS
.model PMOS PMOS
.lib standard.mos
* für jede Kiste (98x)
* Kurzer Streifen
* Langer Streifen
* 3.3V solange gedrückt wird
* 0.5V sonst
.backanno
.end